# EAGLE design giraffe (EAGLE 9.1.0)

## Sheet 1 of 2
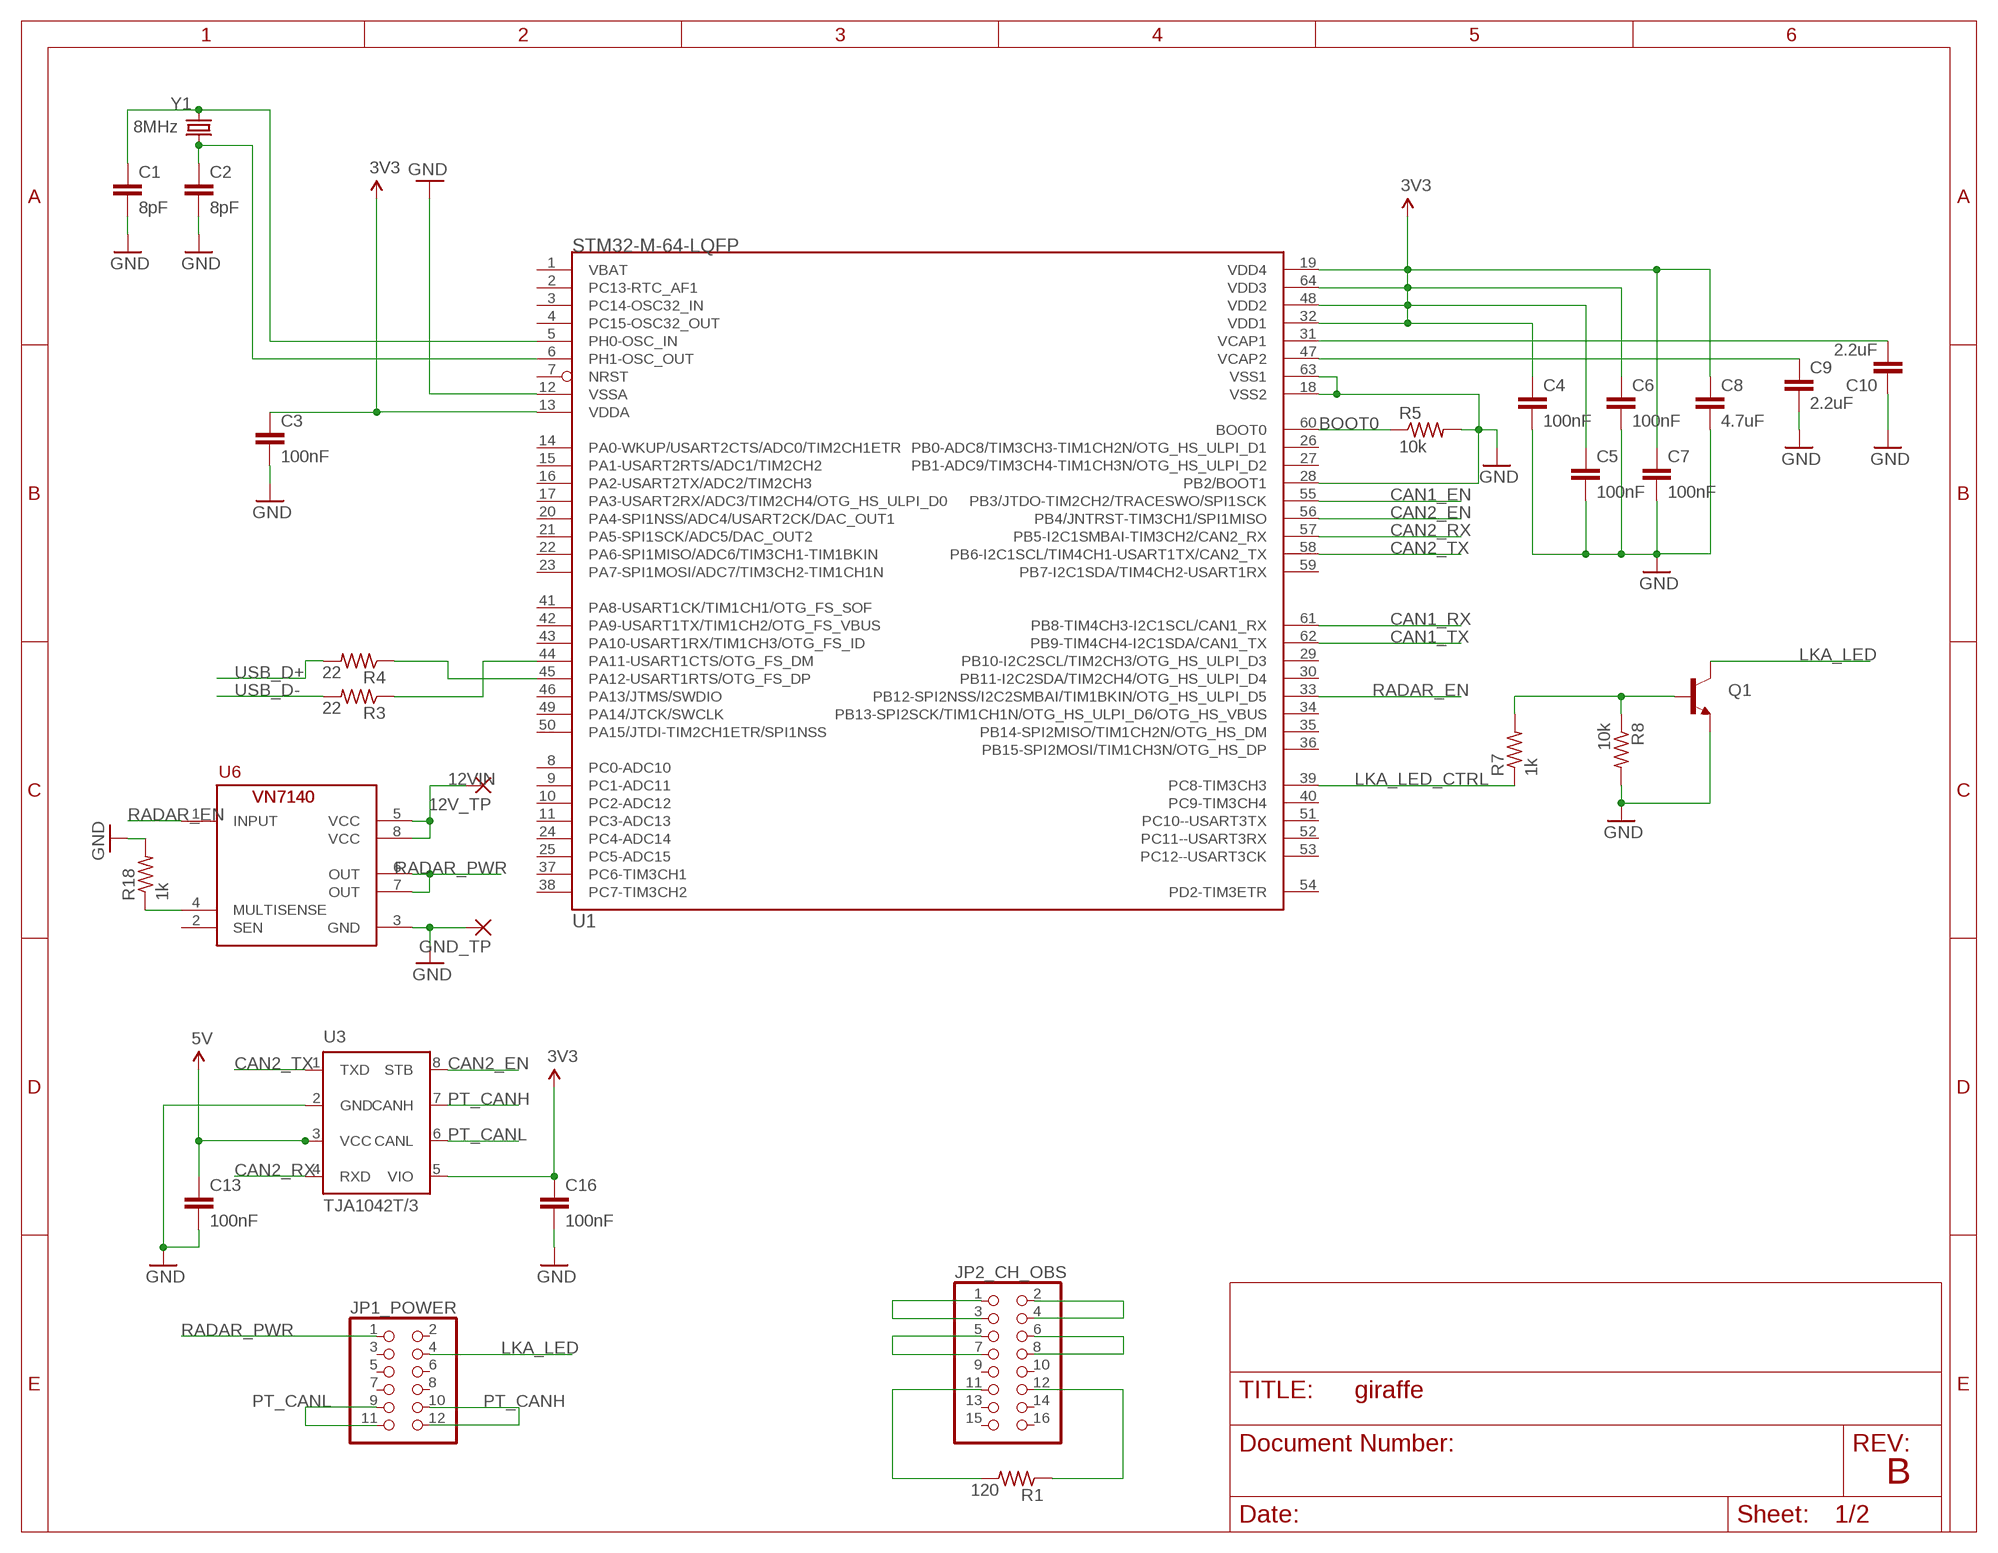
[diagram p0: schematic, sheet 1]

### Parts
12V_TP  2,15/1,0  [2,15/1,0]
C1  8pF  1.0UF-16V-10%(0603)  [0603-CAP]
C2  8pF  1.0UF-16V-10%(0603)  [0603-CAP]
C3  100nF  1.0UF-16V-10%(0603)  [0603-CAP]
C4  100nF  1.0UF-16V-10%(0603)  [0603-CAP]
C5  100nF  1.0UF-16V-10%(0603)  [0603-CAP]
C6  100nF  0.1UF-25V-5%(0603)  [0603-CAP]
C7  100nF  1.0UF-16V-10%(0603)  [0603-CAP]
C8  4.7uF  1.0UF-16V-10%(0603)  [0603-CAP]
C9  2.2uF  1.0UF-16V-10%(0603)  [0603-CAP]
C10  2.2uF  1.0UF-16V-10%(0603)  [0603-CAP]
C13  100nF  CAP0603-CAP  [0603-CAP]
C16  100nF  CAP0603-CAP  [0603-CAP]
GND_TP  2,15/1,0  [2,15/1,0]
JP1_POWER  PINHD-2X6  [2X06]
JP2_CH_OBS  PINHD-2X8  [2X08]
Q1  MMBT2222A  TRANSISTOR_NPNMMBT2222A  [SOT23-3]
R1  120  R-US_R0603  [R0603]
R3  22  R-US_R0603  [R0603]
R4  22  R-US_R0603  [R0603]
R5  10k  R-US_R0603  [R0603]
R7  1k  R-US_R0603  [R0603]
R8  10k  R-US_R0603  [R0603]
R18  1k  R-US_R0603  [R0603]
U1  STM32-M-64-LQFP  [LQFP64]
U3  TJA1042T/3  [SO-8-L]
U6  VN7140  [SO08]
Y1  8MHz  CRYSTALTXC-7A  [CRYSTAL-TXC-7A]

### Nets
3V3: C3.1 C4.1 C5.1 C6.1 C7.1 C8.1 C16.1 U1.13(VDDA) U1.19(VDD4) U1.32(VDD1) U1.48(VDD2) U1.64(VDD3) U3.5(VIO) ; also sheet 2
5V: C13.1 U3.3(VCC) ; also sheet 2
12VIN: 12V_TP.1(P) U6.5(VCC) U6.8(VCC) ; also sheet 2
BOOT0: R5.1 U1.60(BOOT0)
CAN1_EN: U1.55(PB3/JTDO-TIM2CH2/TRACESWO/SPI1SCK)
CAN1_RX: U1.61(PB8-TIM4CH3-I2C1SCL/CAN1_RX)
CAN1_TX: U1.62(PB9-TIM4CH4-I2C1SDA/CAN1_TX)
CAN2_EN: U1.56(PB4/JNTRST-TIM3CH1/SPI1MISO) U3.8(STB)
CAN2_RX: U1.57(PB5-I2C1SMBAI-TIM3CH2/CAN2_RX) U3.4(RXD)
CAN2_TX: U1.58(PB6-I2C1SCL/TIM4CH1-USART1TX/CAN2_TX) U3.1(TXD)
GND: C1.2 C2.2 C3.2 C4.2 C5.2 C6.2 C7.2 C8.2 C9.2 C10.1 C13.2 C16.2 GND_TP.1(P) Q1.2(E) R5.2 R8.2 R18.2 U1.12(VSSA) U1.18(VSS2) U1.28(PB2/BOOT1) U1.63(VSS1) U3.2(GND) U6.3(GND) ; also sheet 2
LKA_LED: JP1_POWER.4 Q1.3(C)
LKA_LED_CTRL: R7.1 U1.39(PC8-TIM3CH3)
N$1: C1.1 U1.5(PH0-OSC_IN) Y1.P$1
N$2: JP2_CH_OBS.2 JP2_CH_OBS.4
N$3: C2.1 U1.6(PH1-OSC_OUT) Y1.P$2
N$5: R4.1 U1.45(PA12-USART1RTS/OTG_FS_DP)
N$6: JP2_CH_OBS.1 JP2_CH_OBS.3
N$7: Q1.1(B) R7.2 R8.1
N$8: JP2_CH_OBS.6 JP2_CH_OBS.8
N$10: JP2_CH_OBS.5 JP2_CH_OBS.7
N$11: R18.1 U6.4(MULTISENSE)
N$12: JP2_CH_OBS.11 R1.2
N$13: JP2_CH_OBS.12 R1.1
N$35: R3.1 U1.44(PA11-USART1CTS/OTG_FS_DM)
PT_CANH: JP1_POWER.10 JP1_POWER.12 U3.7(CANH)
PT_CANL: JP1_POWER.9 JP1_POWER.11 U3.6(CANL)
RADAR_EN: U1.33(PB12-SPI2NSS/I2C2SMBAI/TIM1BKIN/OTG_HS_ULPI_D5) U6.1(INPUT)
RADAR_PWR: JP1_POWER.1 U6.6(OUT) U6.7(OUT)
USB_D+: R4.2
USB_D-: R3.2
VCAP1: C10.2 U1.31(VCAP1)
VCAP2: C9.1 U1.47(VCAP2)
Unconnected: JP1_POWER.2 JP1_POWER.3 JP1_POWER.5 JP1_POWER.6 JP1_POWER.7 JP1_POWER.8 JP2_CH_OBS.9 JP2_CH_OBS.10 JP2_CH_OBS.13 JP2_CH_OBS.14 JP2_CH_OBS.15 JP2_CH_OBS.16 U1.1(VBAT) U1.2(PC13-RTC_AF1) U1.3(PC14-OSC32_IN) U1.4(PC15-OSC32_OUT) U1.7(NRST) U1.8(PC0-ADC10) U1.9(PC1-ADC11) U1.10(PC2-ADC12) U1.11(PC3-ADC13) U1.14(PA0-WKUP/USART2CTS/ADC0/TIM2CH1ETR) U1.15(PA1-USART2RTS/ADC1/TIM2CH2) U1.16(PA2-USART2TX/ADC2/TIM2CH3) U1.17(PA3-USART2RX/ADC3/TIM2CH4/OTG_HS_ULPI_D0) U1.20(PA4-SPI1NSS/ADC4/USART2CK/DAC_OUT1) U1.21(PA5-SPI1SCK/ADC5/DAC_OUT2) U1.22(PA6-SPI1MISO/ADC6/TIM3CH1-TIM1BKIN) U1.23(PA7-SPI1MOSI/ADC7/TIM3CH2-TIM1CH1N) U1.24(PC4-ADC14) U1.25(PC5-ADC15) U1.26(PB0-ADC8/TIM3CH3-TIM1CH2N/OTG_HS_ULPI_D1) U1.27(PB1-ADC9/TIM3CH4-TIM1CH3N/OTG_HS_ULPI_D2) U1.29(PB10-I2C2SCL/TIM2CH3/OTG_HS_ULPI_D3) U1.30(PB11-I2C2SDA/TIM2CH4/OTG_HS_ULPI_D4) U1.34(PB13-SPI2SCK/TIM1CH1N/OTG_HS_ULPI_D6/OTG_HS_VBUS) U1.35(PB14-SPI2MISO/TIM1CH2N/OTG_HS_DM) U1.36(PB15-SPI2MOSI/TIM1CH3N/OTG_HS_DP) U1.37(PC6-TIM3CH1) U1.38(PC7-TIM3CH2) U1.40(PC9-TIM3CH4) U1.41(PA8-USART1CK/TIM1CH1/OTG_FS_SOF) U1.42(PA9-USART1TX/TIM1CH2/OTG_FS_VBUS) U1.43(PA10-USART1RX/TIM1CH3/OTG_FS_ID) U1.46(PA13/JTMS/SWDIO) U1.49(PA14/JTCK/SWCLK) U1.50(PA15/JTDI-TIM2CH1ETR/SPI1NSS) U1.51(PC10--USART3TX) U1.52(PC11--USART3RX) U1.53(PC12--USART3CK) U1.54(PD2-TIM3ETR) U1.59(PB7-I2C1SDA/TIM4CH2-USART1RX) U6.2(SEN)

### Notes on the sheet
- B

## Sheet 2 of 2
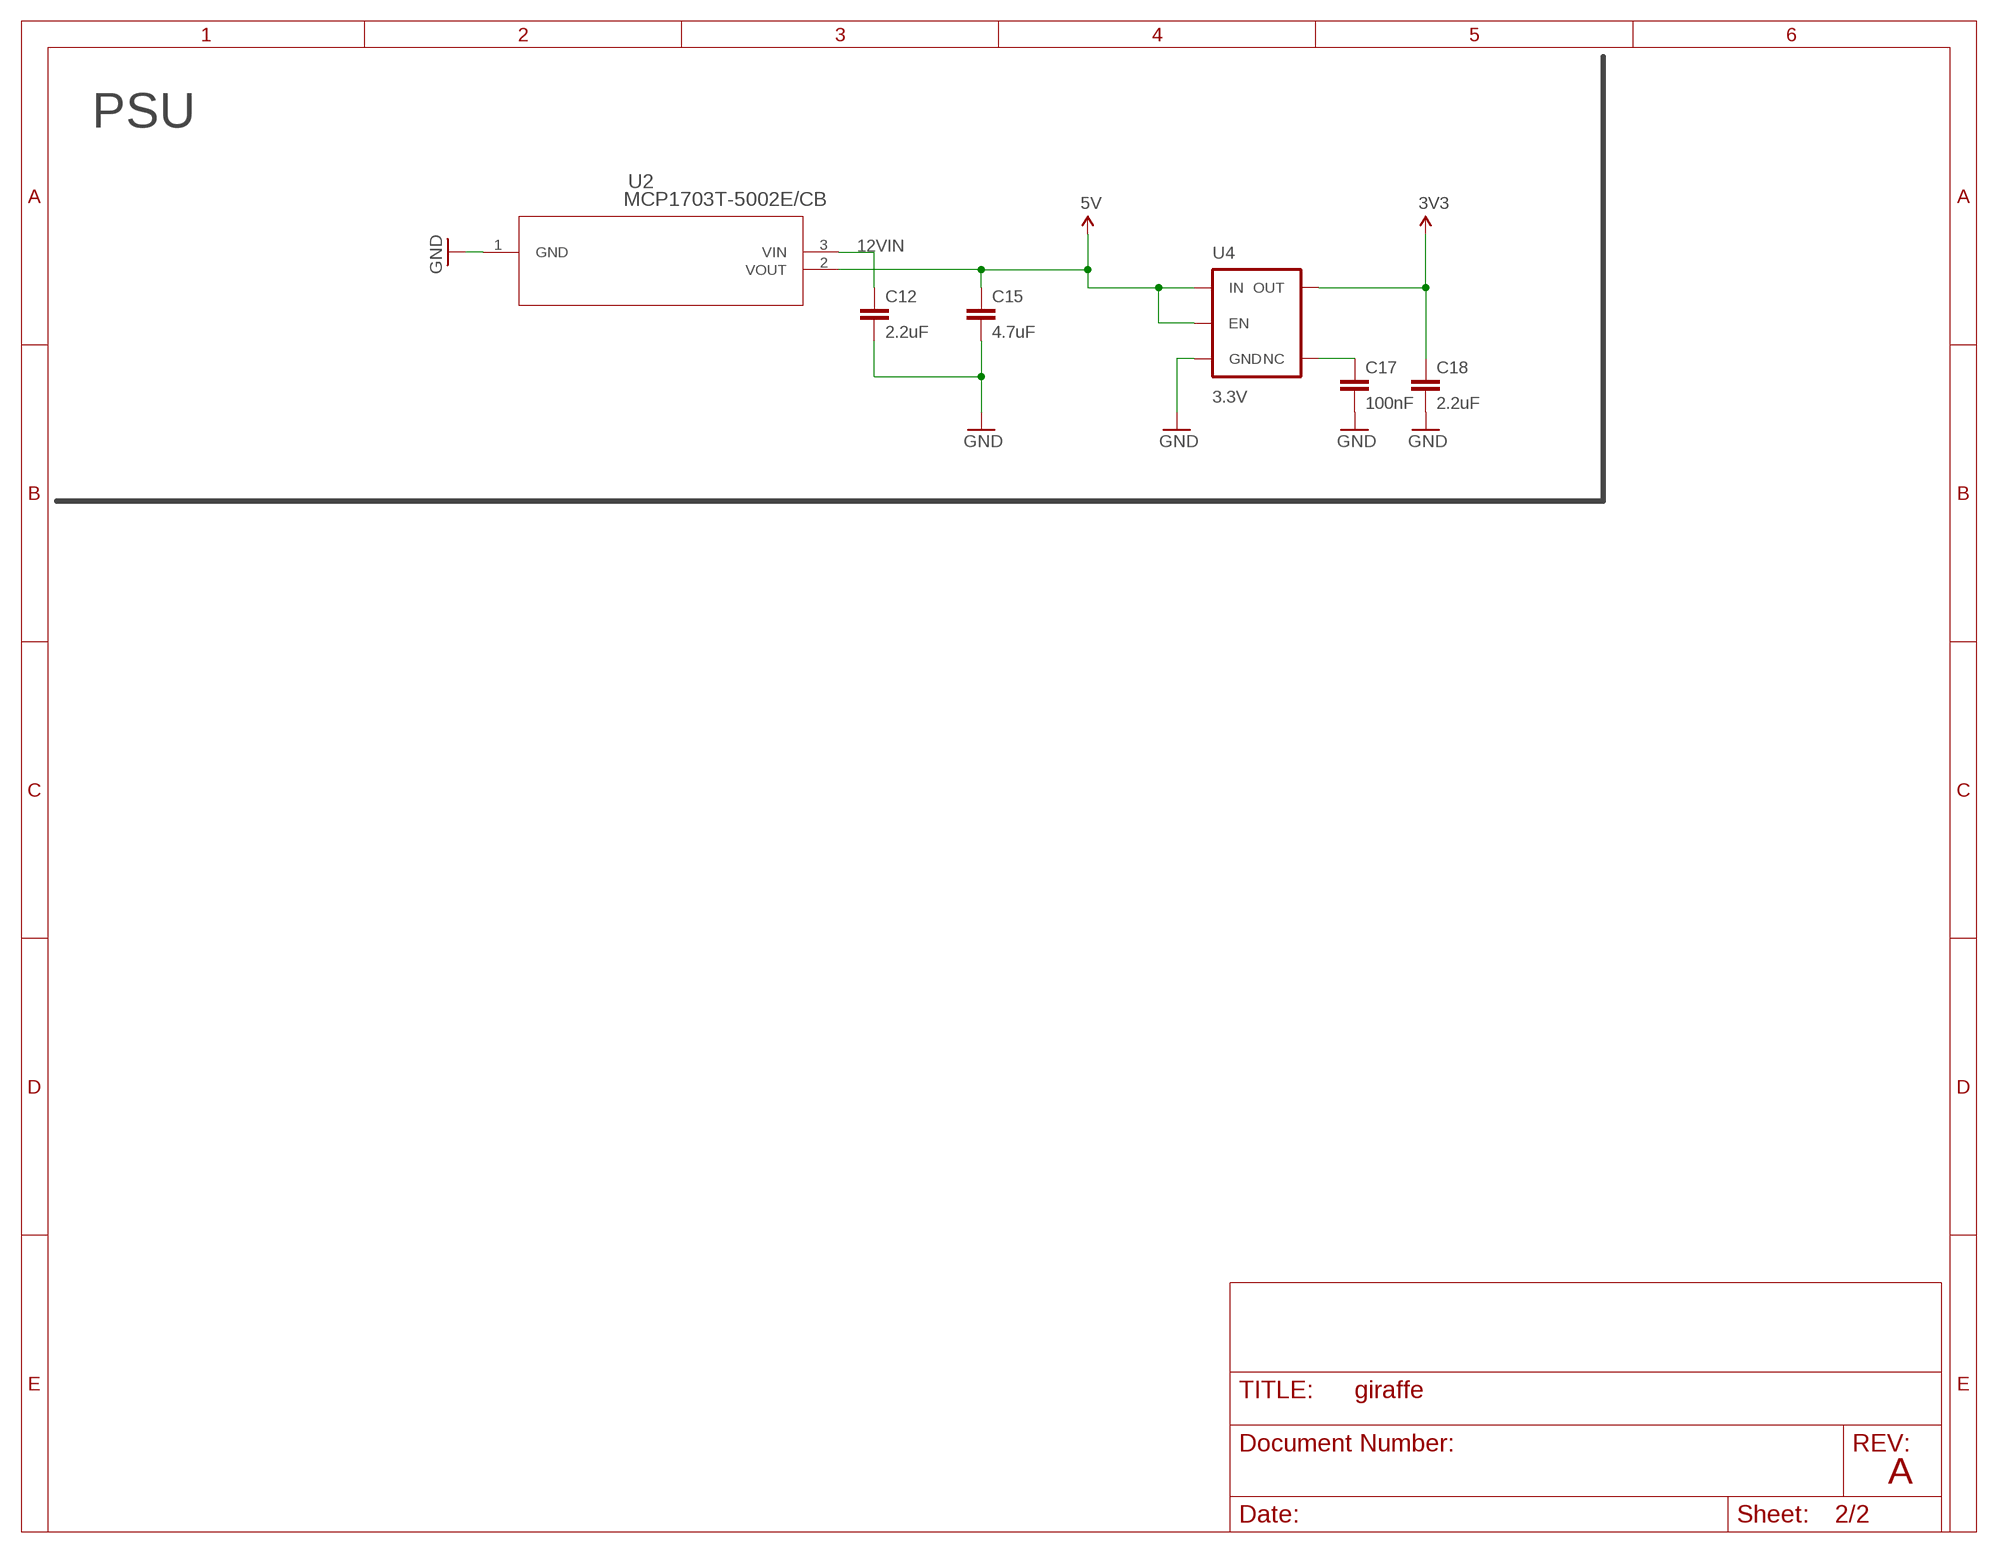
[diagram p1: schematic, sheet 2]

### Parts
C12  2.2uF  2.2UF-25V-+80/-20(0805)  [0805-CAP]
C15  4.7uF  CAP0603-CAP  [0603-CAP]
C17  100nF  CAP0603-CAP  [0603-CAP]
C18  2.2uF  CAP0603-CAP  [0603-CAP]
U2  MCP1703T-5002E/CB  [SOT-23A_MC]
U4  3.3V  V_REG_AP2112K-3.3V  [SOT23-5]

### Nets
3V3: C18.1 U4.5(OUT) ; also sheet 1
5V: C15.1 U2.2(VOUT) U4.1(IN) U4.3(EN) ; also sheet 1
12VIN: C12.1 U2.3(VIN) ; also sheet 1
GND: C12.2 C15.2 C17.2 C18.2 U2.1(GND) U4.2(GND) ; also sheet 1
N$29: C17.1 U4.4(NC)

### Notes on the sheet
- PSU
- A

## Library data of the parts
12V_TP GND_TP = wirepad:2,15/1,0: THROUGH-HOLE PAD
C1-C5 C7-C10 = SparkFun-Capacitors:1.0UF-16V-10%(0603): CAP-00868; PROD_ID: CAP-00868; VALUE: 1.0uF
C6 = SparkFun-Capacitors:0.1UF-25V-5%(0603): CAP-08604; PROD_ID: CAP-08604; VALUE: 0.1uF
C12 = SparkFun-Capacitors:2.2UF-25V-+80/-20(0805): CAP-11624; PROD_ID: CAP-11624
C13 C15-C18 = SparkFun-Capacitors:CAP: Capacitor Standard 0603 ceramic capacitor, and 0.1" leaded capacitor.
JP1_POWER = pinhead:PINHD-2X6: PIN HEADER
JP2_CH_OBS = pinhead:PINHD-2X8: PIN HEADER
Q1 = SparkFun-DiscreteSemi:TRANSISTOR_NPN: Generic NPN BJT MMBT2222A - TRANS-08049 (SOT-23, 1A 40V) MPSA42 - TRANS-09116 (SOT-23, 500mA 300V) MMBT5088LT1G - TRANS-11160 (SOT-23, 50 mA 30V) BC547 - COM-08928 <http://www.sparkfun.com/products/8928> (TO-92 45V 100mA) (1.Collector 2.Base 3.Emitter) 2N3904 - COM-00521 <http://www.sparkfun.com/products/521> (TO-92 40V 200mA) (1.Emitter 2.Base 3.Collector) P2N2222A - COM-12852 <http://www.sparkfun.com/products/12852> (TO-92 40V 600mA) (1.Collector 2.Base 3.Emitter); PROD_ID: TRANS-08049
R1 R3-R5 R7 R8 R18 = adafruit:R-US_: RESISTOR, American symbol
U1 = parts_:STM32-M-64-LQFP: STM32F103 Medium Density 64pin LQFP
U2 = 1703:MCP1703T-5002E/CB; MANUFACTURER_PART_NUMBER: MCP1703T5002ECB; VENDOR: Microchip
U3 = TJA1042T:TJA1042T
U4 = SparkFun-PowerIC:V_REG_AP2112: AP2112 - 600mA CMOS LDO Regulator w/ Enable The AP2112 is CMOS process low dropout linear regulator with enable function, the regulator delivers a guaranteed 600mA (min.) continuous load current. Features Output Voltage Accuracy: ±1.5% Output Current: 600mA (Min.) Foldback Short Current Protection: 50mA Enable Function to Turn ON/OFF VOUT Low Dropout Voltage (3.3V): 250mV (Typ.) @IOUT=600mA Excellent Load Regulation: 0.2%/A (Typ.) Excellent Line Regulation: 0.02%/V (Typ.) Low Quiescent Current: 55μA (Typ.) Low Standby Current: 0.01μA (Typ.) Low Output Noise: 50μVRMS PSRR: 100Hz -65dB, 1kHz -65dB OTSD Protection Stable with 1.0μF Flexible Cap: Ceramic, Tantalum and Aluminum Electrolytic Operation Temperature Range: -40°C to 85°C ESD: MM 400V, HBM 4000V; PROD_ID: VREG-12457
U6 = parts:VN7140: VN7050/VN7140 High side switch
Y1 = SparkFun-FreqCtrl:CRYSTAL: Various standard crystals. Proven footprints.

## Board
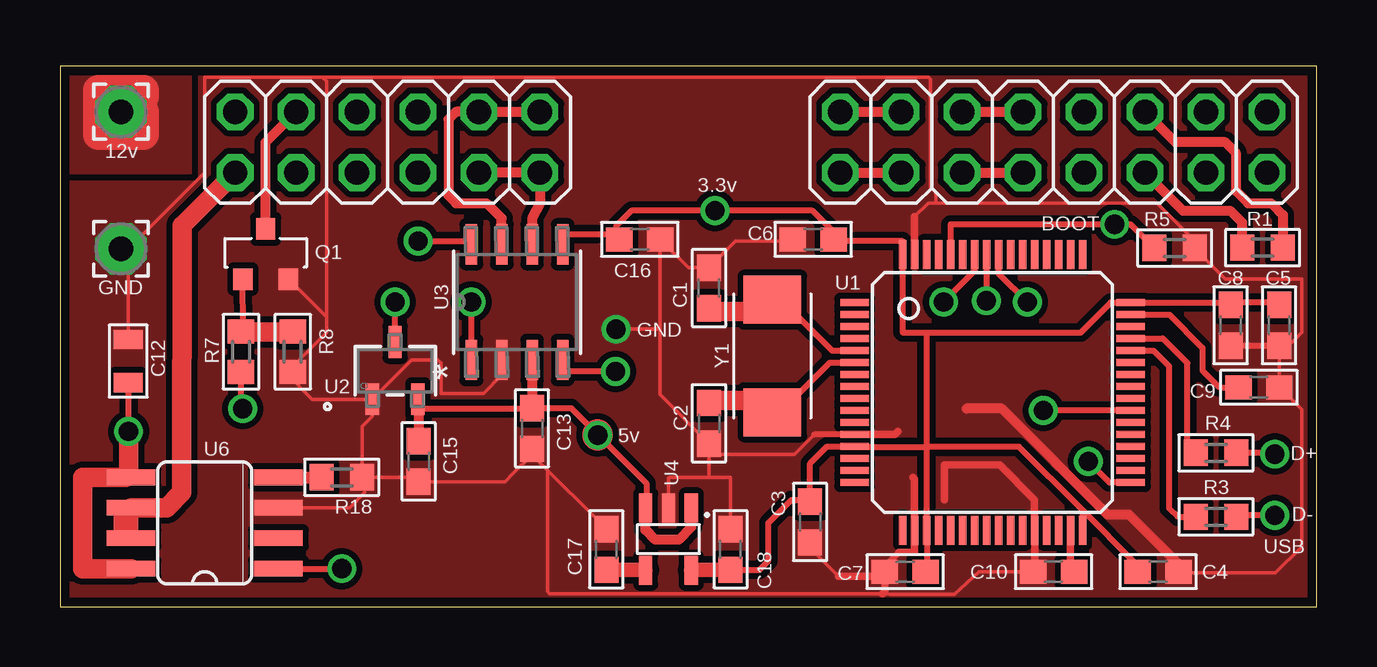
[diagram p2: board, top side]
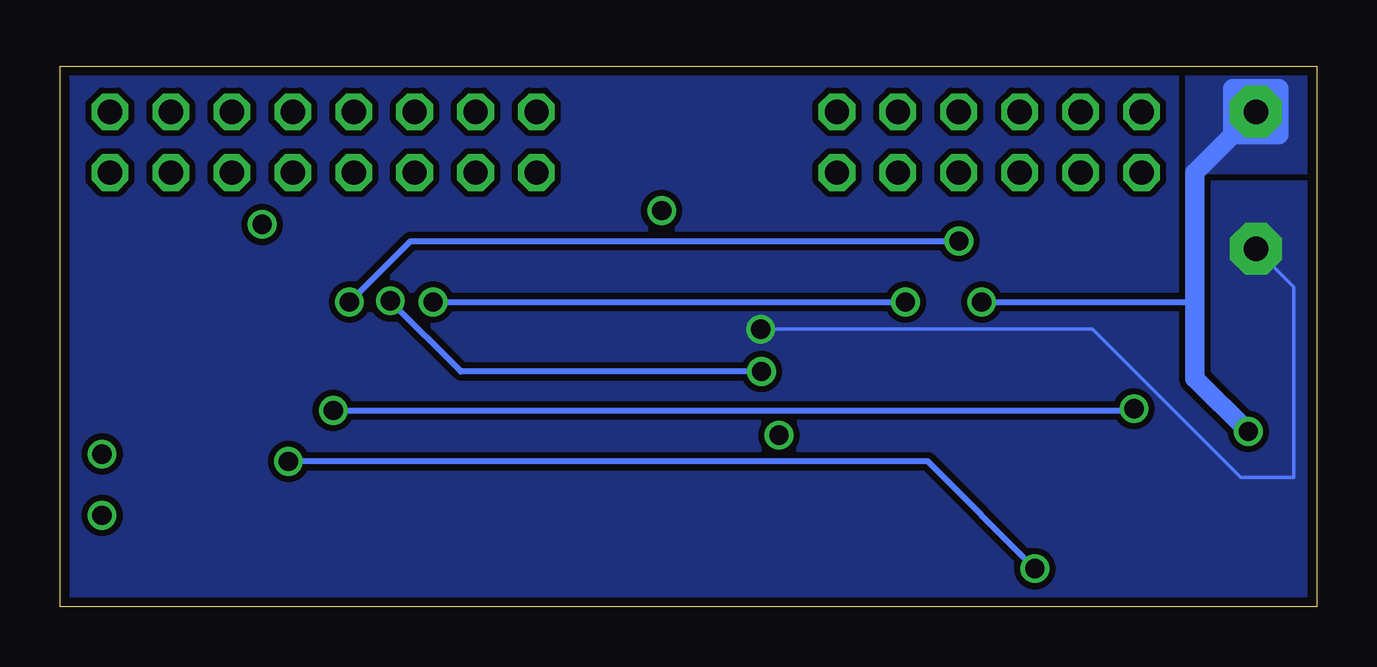
[diagram p3: board, bottom side, seen from below]

Size 52.39 x 22.54 mm. Coordinates in mm from the lower left corner, seen from the top.
Outline: 0,22.54 0,0 52.39,0 52.39,22.54 0,22.54
Copper layers (1*16): Top 0.0356mm / dielectric 1.5011mm / Bottom 0.0356mm
Design rules "oshpark-2layer": minimum track width 6mil, minimum drill 13mil, track to track 6mil, track to pad 6mil, pad to pad 6mil, via to via 6mil, smd to smd 6mil, copper to edge 15mil, drill to drill 6mil, minimum pad ring 7mil, minimum via ring 7mil, stop-mask expansion 2.5mil, vias tented up to drill 0mil, thermal gap 10mil

### Footprints (pad centres in the part's own frame; a part is rotated, then mirrored left to right if it is on the bottom)
2,15/1,0 = drill 1.016 pad 2.159 octagon: 1 0,0
0603-CAP = smd 1.1 x 1: 1 -0.85,0; 2 0.85,0
0805-CAP = smd 0.8 x 1.2: 1 -0.9,0; 2 0.9,0
2X06 = drill 1.016 octagon: 1 -6.35,-1.27; 2 -6.35,1.27; 3 -3.81,-1.27; 4 -3.81,1.27; 5 -1.27,-1.27; 6 -1.27,1.27; 7 1.27,-1.27; 8 1.27,1.27; 9 3.81,-1.27; 10 3.81,1.27; 11 6.35,-1.27; 12 6.35,1.27
2X08 = drill 1.016 octagon: 1 -8.89,-1.27; 2 -8.89,1.27; 3 -6.35,-1.27; 4 -6.35,1.27; 5 -3.81,-1.27; 6 -3.81,1.27; 7 -1.27,-1.27; 8 -1.27,1.27; 9 1.27,-1.27; 10 1.27,1.27; 11 3.81,-1.27; 12 3.81,1.27; 13 6.35,-1.27; 14 6.35,1.27; 15 8.89,-1.27; 16 8.89,1.27
SOT23-3 = smd 0.8 x 0.9: 1 -0.95,-1; 2 0.95,-1; 3 0,1.1
R0603 = smd 1 x 1.1: 1 -0.85,0; 2 0.85,0
LQFP64 = smd 1.2 x 0.3: 1 -5.75,3.75; 2 -5.75,3.25; 3 -5.75,2.75; 4 -5.75,2.25; 5 -5.75,1.75; 6 -5.75,1.25; 7 -5.75,0.75; 8 -5.75,0.25; 9 -5.75,-0.25; 10 -5.75,-0.75; 11 -5.75,-1.25; 12 -5.75,-1.75; 13 -5.75,-2.25; 14 -5.75,-2.75; 15 -5.75,-3.25; 16 -5.75,-3.75; 33 5.75,-3.75; 34 5.75,-3.25; 35 5.75,-2.75; 36 5.75,-2.25; 37 5.75,-1.75; 38 5.75,-1.25; 39 5.75,-0.75; 40 5.75,-0.25; 41 5.75,0.25; 42 5.75,0.75; 43 5.75,1.25; 44 5.75,1.75; 45 5.75,2.25; 46 5.75,2.75; 47 5.75,3.25; 48 5.75,3.75 | smd 0.3 x 1.2: 17 -3.75,-5.75; 18 -3.25,-5.75; 19 -2.75,-5.75; 20 -2.25,-5.75; 21 -1.75,-5.75; 22 -1.25,-5.75; 23 -0.75,-5.75; 24 -0.25,-5.75; 25 0.25,-5.75; 26 0.75,-5.75; 27 1.25,-5.75; 28 1.75,-5.75; 29 2.25,-5.75; 30 2.75,-5.75; 31 3.25,-5.75; 32 3.75,-5.75; 49 3.75,5.75; 50 3.25,5.75; 51 2.75,5.75; 52 2.25,5.75; 53 1.75,5.75; 54 1.25,5.75; 55 0.75,5.75; 56 0.25,5.75; 57 -0.25,5.75; 58 -0.75,5.75; 59 -1.25,5.75; 60 -1.75,5.75; 61 -2.25,5.75; 62 -2.75,5.75; 63 -3.25,5.75; 64 -3.75,5.75
SOT-23A_MC = smd 0.559 x 1.321: 1 -0.95,-1.195; 2 0.95,-1.195; 3 0,1.195
SO-8-L = smd 1.676 x 0.483: 1 -2.413,1.905; 2 -2.413,0.635; 3 -2.413,-0.635; 4 -2.413,-1.905; 5 2.413,-1.905; 6 2.413,-0.635; 7 2.413,0.635; 8 2.413,1.905
SOT23-5 = smd 0.55 x 1.2: 1 -0.95,-1.3; 2 0,-1.3; 3 0.95,-1.3; 4 0.95,1.3; 5 -0.95,1.3
SO08 = smd 0.66 x 2.032: 1 -1.905,-3.073; 2 -0.635,-3.073; 3 0.635,-3.073; 4 1.905,-3.073; 5 1.905,3.073; 6 0.635,3.073; 7 -0.635,3.073; 8 -1.905,3.073
CRYSTAL-TXC-7A = smd 2 x 2.4: P$1 2.35,0; P$2 -2.35,0

### Placement (x,y rotation side)
12V_TP  2.54,20.64 0 top
C1  27.05,13.28 90 top
C2  27.05,7.65 270 top
C3  31.27,3.53 270 top
C4  45.77,1.46 0 top
C5  50.81,11.73 270 top
C6  31.39,15.32 180 top
C7  35.23,1.46 180 top
C8  48.79,11.73 270 top
C9  49.97,9.14 0 top
C10  41.41,1.46 0 top
C12  2.84,10.24 90 top
C13  19.67,7.43 270 top
C15  14.95,6.06 270 top
C16  24.17,15.32 0 top
C17  22.77,2.39 90 top
C18  27.95,2.39 90 top
GND_TP  2.54,14.92 0 top
JP1_POWER  13.65,19.37 0 top
JP2_CH_OBS  41.41,19.37 0 top
Q1  8.57,14.66 0 top
R1  50.13,14.97 180 top
R3  48.18,3.75 0 top
R4  48.18,6.41 0 top
R5  46.46,14.96 0 top
R7  7.54,10.63 90 top
R8  9.7,10.63 270 top
R18  11.75,5.4 0 top
U1  38.87,8.93 0 top
U2  13.97,9.84 0 top
U3  19.05,12.7 90 top
U4  25.36,2.82 180 top
U6  6.03,3.49 90 top
Y1  29.69,10.45 90 top

### Tracks (layer width: path | path; a pad name or v marks a point on that pad's centre or on a via)
3V3  (via drill 0.8)
  Top 0.152: U1.64 35.12,15.24
  Top 0.254: 35.12,15.24 32.32,15.24 C6.1 32.24,15.63 31.37,16.51 v27.31,16.51 23.81,16.51 23.18,15.88 23.18,15.53 | C7.1 36.14,1.52 36.14,3.17 U1.19 36.12,6.67 | C3.1 31.27,4.45 | 31.27,4.45 31.27,5.97 31.98,6.68 U1.13 33.14,6.67 36.12,6.67 | C18.1 29.16,1.54 29.53,1.91 29.53,3.49 30.48,4.45 31.27,4.45 | U3.5 20.95,15.53 23.18,15.53 | C16.1 23.18,15.32 23.18,15.53 | 50.72,12.68 C5.1 50.72,12.68 | 36.12,6.67 36.12,11.4 36.16,11.4 36.2,11.43 | 42.53,4.11 39.98,6.67 36.12,6.67 | 42.53,4.11 42.62,4.02 U1.32 | 42.53,4.11 44.91,1.73 C4.1 | U1.64 35.12,11.44 35.14,11.43 36.2,11.43 | 36.2,11.43 42.55,11.43 43.8,12.68 U1.48 48.79,12.68 | C8.1 48.79,12.68 | 50.72,12.68 48.79,12.68
  Top 0.61: C18.1 26.33,1.54 U4.5
5V  (via drill 0.8)
  Top 0.152: U2.2 14.92,8.31 14.99,8.25 | U4.3 24.42,4.13 24.45,4.13
  Top 0.254: 24.45,4.13 24.45,5.14 22.42,7.18 21.31,8.28 C13.1 19.69,8.29 19.69,8.25 15.31,8.25 14.99,8.25
  Top 0.406: U4.1 26.31,3.31 25.79,2.79 24.8,2.79 24.4,3.2 24.4,4.1 U4.3 | U3.3 19.69,8.29 | U2.2 14.95,8.62 C15.1
  Top 1.27: v22.42,7.15 22.42,7.18
12VIN  (via drill 0.8)
  Top 0.254: U2.3 v13.97,12.7 | 2.84,5.51 U6.5 2.86,5.5 | v2.86,7.3 C12.1
  Top 0.508: 2.73,5.4 2.84,5.51
  Top 0.813: U6.8 0.95,1.59 0.95,5.4 2.73,5.4 | v2.86,7.3 2.86,5.5 | C12.1
  Top 1.27: 12V_TP.1 3.49,20.64 3.49,19.68 1.59,19.68 1.59,21.53 3.49,21.53 3.49,21.27
  Bottom 0.254: v13.97,12.7 5.08,12.7 | 5.08,12.7 5.08,14.92 | 5.08,9.53 5.08,12.7
  Bottom 0.508: 5.08,15.56 5.08,14.92
  Bottom 0.813: v2.86,7.3 5.08,9.53 5.08,15.56 5.08,18.1 3.49,19.68 | 3.49,19.68 3.49,21.59 1.59,21.59 1.59,19.68 3.49,19.68 | 3.49,19.68 12V_TP.1 3.49,19.68
  pour Top: 5.42,22.21 5.42,18.08 0.32,18.1 0.32,22.22
  pour Bottom: 0.32,18.1 0.32,22.22 5.42,22.22 5.42,18.1
BOOT0  (via drill 0.8)
  Top 0.254: R5.1 44.63,15.94 v43.95,15.94 37.12,15.94 U1.60
CAN2_EN  (via drill 0.8)
  Top 0.254: U1.56 39.12,13.9 v40.32,12.7 | v14.92,15.24 17.02,15.24 U3.8
  Bottom 0.254: v40.32,12.7 37.78,15.24 v14.92,15.24
CAN2_RX  (via drill 0.8)
  Top 0.254: U1.57 v38.62,12.75 | v23.15,9.8 20.95,9.8 U3.4
  Bottom 0.254: v23.15,9.8 35.67,9.8 v38.62,12.75
CAN2_TX  (via drill 0.8)
  Top 0.254: U1.58 38.12,13.99 v36.83,12.7 | v17.14,12.7 U3.1
  Bottom 0.254: v36.83,12.7 v17.14,12.7
GND  (via drill 0.8)
  Top 0.152: C6.2 30.47,15.24 28.16,15.24 C1.2 26.2,14.13 C16.2 25.02,12.71 25.01,12.7 25.01,11.75 25.01,11.57 | C2.2 25.01,8.84 25.01,11.57 | C2.2 27.5,6.35 30.62,6.35 31.45,7.18 | 32.45,1.27 31.27,2.45 C3.2 | 26.99,5.4 25.4,5.4 25.36,5.36 U4.2 | 26.99,5.4 27.94,5.4 27.95,5.38 C18.2 | C2.2 27.05,5.46 26.99,5.4 | 19.67,6.34 C13.2 19.67,6.34 | R18.2 12.6,7.52 13.02,7.94 U2.1 | 9.58,9.9 R8.2 | U6.3 12.06,4.13 12.7,4.76 12.7,5.29 R18.2 | Q1.2 11.12,12.07 | 9.58,9.9 11.11,11.43 11.11,11.76 11.12,11.77 11.12,12.07 | 10.93,22.09 6.03,22.09 6.03,18.42 6.03,18.1 3.18,15.24 GND_TP.1 2.84,14.62 C12.2 | 10.93,22.09 11.11,21.91 11.11,12.08 11.12,12.07 | C5.2 C9.2 51.75,8.22 51.75,2.5 50.66,1.41 46.67,1.41 C4.2 | C5.2 | 36.51,16.83 45.72,16.83 47.31,15.24 R5.2 47.31,14.92 48.58,13.65 51.75,13.65 51.75,11.43 51.2,10.87 C5.2 | 36.51,16.83 36.2,16.83 35.62,16.26 | U2.1 14.66,10.29 15.74,10.29 15.88,10.15 15.88,8.89 17.65,8.89 18.42,9.65 U3.2 | 34.3,1.46 34.3,1.27 34.3,0.76 | 19.67,6.34 19.83,6.18 | 19.83,6.18 C17.2 | 18.85,5.51 18.89,5.56 | 18.89,5.56 19.67,6.34 | 13.02,5.4 R18.2 | 36.51,16.83 36.51,17.26 36.28,17.49 36.28,22 36.2,22.09 10.93,22.09 | 19.83,6.18 20.32,5.69 20.32,0.64 20.41,0.55 34.29,0.55 34.52,0.55 34.59,0.51 37.29,0.51 38.3,1.46 C10.1 40.64,1.53 | 25.01,11.57 v23.18,11.57 | U2.1 10.52,8.65 9.42,9.74 9.58,9.9 | R18.2 14.76,5.4 | C15.2 18.54,5.21 18.89,5.56
  Top 0.254: U1.12 31.45,7.18 | 34.98,2.26 34.62,1.91 33.99,1.27 | C8.2 C5.2 | C7.2 34.3,1.46
  Top 0.305: 34.3,1.27 33.99,1.27 33.02,1.27 32.45,1.27 | 40.64,1.53 40.64,3.17 U1.28 40.62,4.46 39.17,5.92 36.87,5.92 36.87,4.45 | U1.63 35.62,16.26 | 35.56,5.4 35.62,5.33 35.62,4.76 U1.18 35.62,2.27 34.98,2.27 34.98,2.26 | C7.2 34.38,0.64 34.29,0.55 | U1.12 34.8,7.18 34.92,7.3 | 14.76,5.4 C15.2
  Top 0.406: 37.78,8.25 39.25,8.25 43.67,3.83 44.57,3.83 46.62,1.78 C4.2
  Bottom 0.152: v23.18,11.57 9.35,11.57 3.18,5.4 0.95,5.4 0.95,13.34 GND_TP.1
  pour Top (isolate 0.254, rank 2, no thermals): 0,22.54 0.01,0 52.39,0 52.39,22.54
  pour Bottom (isolate 0.254, rank 2, no thermals): 0,0 52.39,0 52.39,22.54 0,22.54
LKA_LED
  Top 0.152: 8.57,15.77 Q1.3 8.62,16.14 8.57,16.19
  Top 0.254: Q1.3 8.57,15.77
  Top 0.406: 8.57,16.19 8.57,19.37 JP1_POWER.4
LKA_LED_CTRL  (via drill 0.8)
  Top 0.254: U1.39 v41,8.18 | v7.62,8.25 7.54,8.33 R7.1
  Bottom 0.254: v41,8.18 7.7,8.18 v7.62,8.25
N$1
  Top 0.254: Y1.P$1 30.06,12.8 32.18,10.68 U1.5
  Top 0.813: Y1.P$1 29.11,12.3 27.19,12.3 C1.1
N$2
  Top 0.406: JP2_CH_OBS.2 JP2_CH_OBS.4
N$3
  Top 0.254: Y1.P$2 30.01,8.1 32.09,10.18 U1.6
  Top 0.305: 29.7,8.6 Y1.P$2
  Top 0.813: C2.1 27.17,8.6 29.7,8.6
N$5
  Top 0.254: R4.1 47.05,6.41 46.99,6.35 46.99,10.16 45.96,11.18 U1.45
N$6
  Top 0.406: JP2_CH_OBS.1 JP2_CH_OBS.3
N$7
  Top 0.254: Q1.1 7.64,11.57 7.59,11.48 R7.2
  Top 0.305: 7.57,11.45 R7.2
  Top 0.813: 7.57,11.45 9.7,11.45 R8.1
N$8
  Top 0.406: JP2_CH_OBS.6 JP2_CH_OBS.8
N$10
  Top 0.406: JP2_CH_OBS.5 JP2_CH_OBS.7
N$11
  Top 0.508: U6.4 R18.1
N$12
  Top 0.254: 49.26,14.99 R1.2
  Top 0.406: JP2_CH_OBS.11 46.81,16.51 48.78,16.51 49.26,16.03 49.26,14.99
N$13
  Top 0.406: JP2_CH_OBS.12 46.49,19.37 48.58,19.37 49.01,18.94 49.01,17.35 49.53,16.83 50.48,16.83 50.98,16.33 R1.1
N$29
  Top 0.61: C17.1 24.39,1.54 U4.4
N$35
  Top 0.254: U1.44 45.58,10.68 46.22,10.03 46.22,4.11 46.58,3.75 R3.1
PT_CANH
  Top 0.406: U3.7 18.42,16.19 17.78,16.83 16.51,16.83 16.19,17.14 16.19,20.32 16.51,20.64 JP1_POWER.10 JP1_POWER.12
PT_CANL
  Top 0.406: U3.6 19.69,16.19 20,16.83 JP1_POWER.11 JP1_POWER.9
RADAR_EN  (via drill 0.8)
  Top 0.254: U1.33 43.74,5.18 v42.86,6.06 | U6.1 v11.75,1.59
  Bottom 0.254: v11.75,1.59 16.22,6.06 v42.86,6.06
RADAR_PWR
  Top 0.61: U6.7 U6.6 2.54,3.71 2.54,3.17
  Top 0.813: U6.6 4.45,4.13 5.08,4.76 5.09,15.89 JP1_POWER.1
USB_D+  (via drill 0.8)
  Top 0.254: v50.63,6.36 50.58,6.41 R4.2
USB_D-  (via drill 0.8)
  Top 0.254: v50.63,3.81 49.1,3.81 R3.2
VCAP1
  Top 0.254: 42.14,1.59 C10.2
  Top 0.305: U1.31 42.12,1.6 42.14,1.59
VCAP2
  Top 0.254: U1.47 46.24,12.18 47.62,10.79 47.62,9.84 48.32,9.14 C9.1

### Text on the board
tNames: 12v | 3.3v | BOOT | GND | GND | 5v | D+ | D- | USB